# Altium project Hydrophones_RA_Adapter_2.PrjPCB
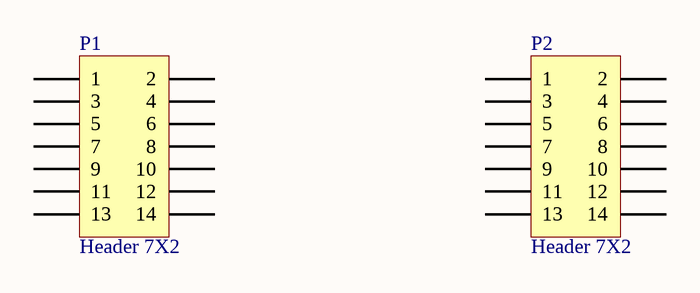
[diagram p0: Hydrophones_RA_Adapter_2.SchDoc]
1 sheet, 2 parts. Net scope: global (net labels, ports and power ports of the same name join across sheets).
Board file: Hydrophones_RA_Adapter_2.PcbDoc

## Sheet Hydrophones_RA_Adapter_2.SchDoc
size A

### Parts
P1  Header 7X2  [FTSH-103-01-L-DH]
P2  Header 7X2  [FTSH-107-01-F-DV]

### Nets

Not connected (* = marked no-connect by the designer): P1 1 2 3 4 5 6 7 8 9 10 11 12 13 14; P2 1 2 3 4 5 6 7 8 9 10 11 12 13 14

### Library data of the parts
P1 P2 = Header 7X2: Header, 7-Pin, Dual row; LatestRevisionDate: 17-Jul-2002; LatestRevisionNote: Re-released for DXP Platform.; Publisher: Altium Limited